# EAGLE design switch (EAGLE 5.10)
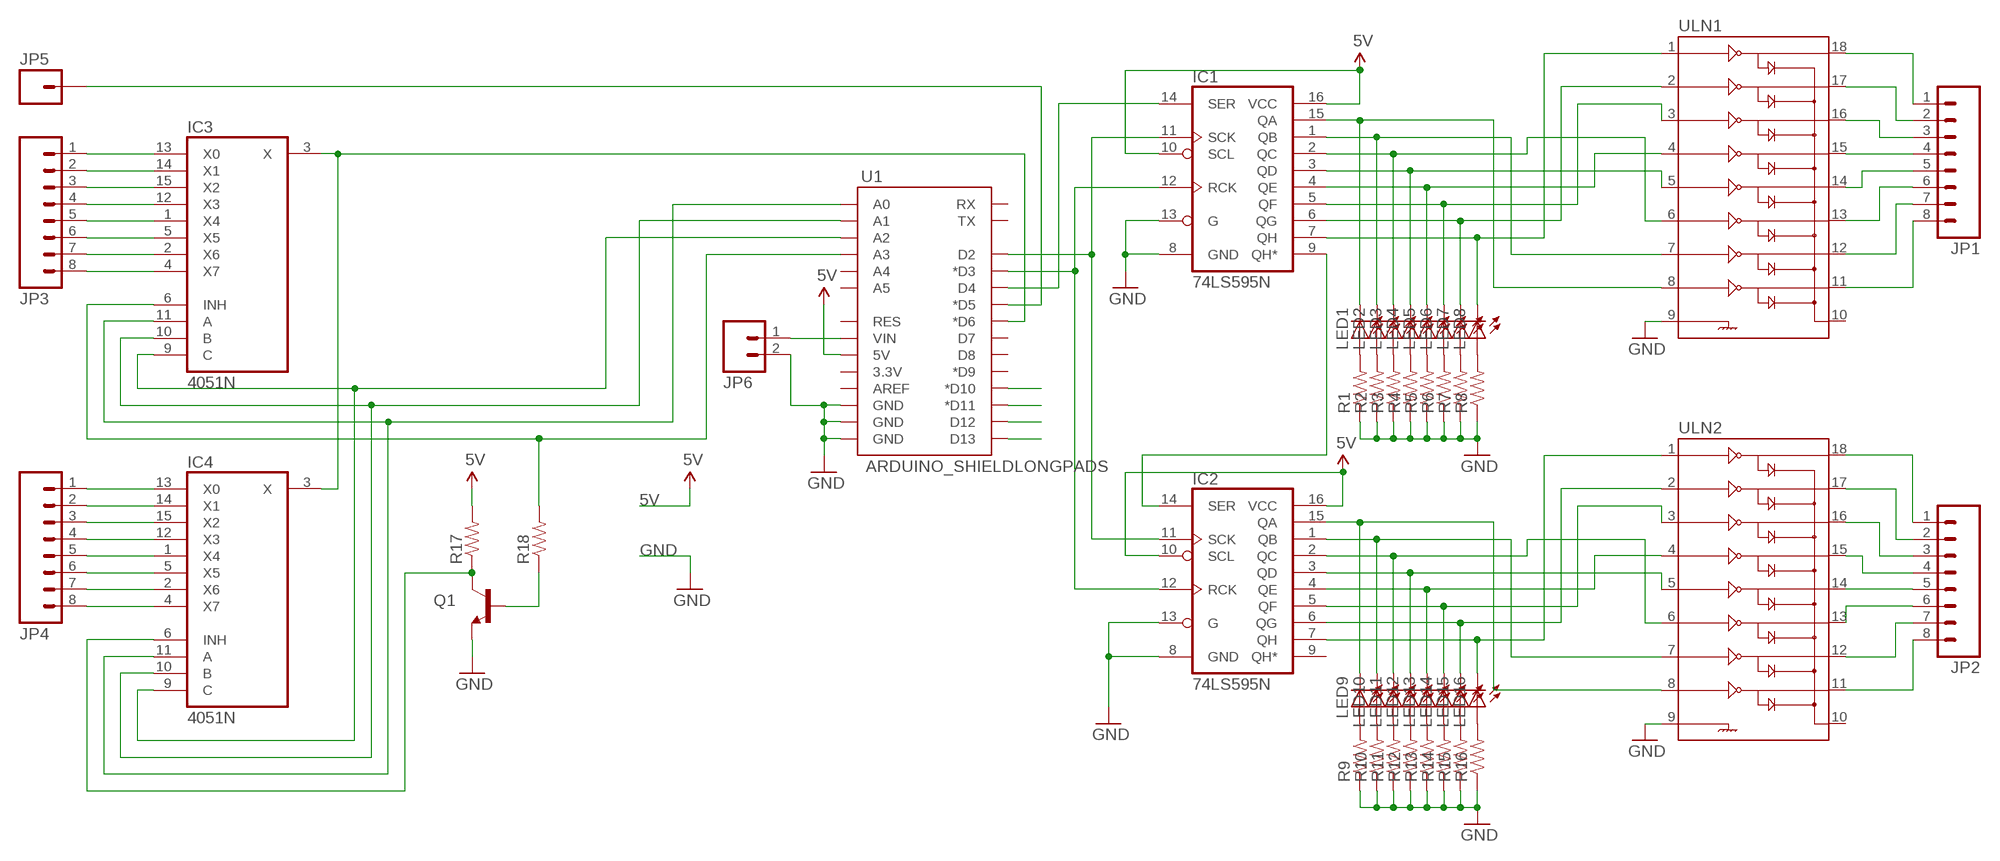
[diagram p0: schematic, sheet 1]

## Parts
IC1  74LS595N  [DIL16]
IC2  74LS595N  [DIL16]
IC3  4051N  [DIL16]
IC4  4051N  [DIL16]
JP1  M08  [1X08]
JP2  M08  [1X08]
JP3  M08  [1X08]
JP4  M08  [1X08]
JP5  M01PTH_LONGPAD  [1X01_LONGPAD]
JP6  M02PTH3  [1X02_LONGPADS]
LED1  LEDCHIPLED_0805  [CHIPLED_0805]
LED2  LEDCHIPLED_0805  [CHIPLED_0805]
LED3  LEDCHIPLED_0805  [CHIPLED_0805]
LED4  LEDCHIPLED_0805  [CHIPLED_0805]
LED5  LEDCHIPLED_0805  [CHIPLED_0805]
LED6  LEDCHIPLED_0805  [CHIPLED_0805]
LED7  LEDCHIPLED_0805  [CHIPLED_0805]
LED8  LEDCHIPLED_0805  [CHIPLED_0805]
LED9  LEDCHIPLED_0805  [CHIPLED_0805]
LED10  LEDCHIPLED_0805  [CHIPLED_0805]
LED11  LEDCHIPLED_0805  [CHIPLED_0805]
LED12  LEDCHIPLED_0805  [CHIPLED_0805]
LED13  LEDCHIPLED_0805  [CHIPLED_0805]
LED14  LEDCHIPLED_0805  [CHIPLED_0805]
LED15  LEDCHIPLED_0805  [CHIPLED_0805]
LED16  LEDCHIPLED_0805  [CHIPLED_0805]
Q1  TRANSISTOR_NPNSOT23  [SOT23]
R1  RESISTOR  [0805]
R2  RESISTOR  [0805]
R3  RESISTOR  [0805]
R4  RESISTOR  [0805]
R5  RESISTOR  [0805]
R6  RESISTOR  [0805]
R7  RESISTOR  [0805]
R8  RESISTOR  [0805]
R9  RESISTOR  [0805]
R10  RESISTOR  [0805]
R11  RESISTOR  [0805]
R12  RESISTOR  [0805]
R13  RESISTOR  [0805]
R14  RESISTOR  [0805]
R15  RESISTOR  [0805]
R16  RESISTOR  [0805]
R17  RESISTOR  [0805]
R18  RESISTOR  [0805]
U1  ARDUINO_SHIELDLONGPADS  [DUEMILANOVE_SHIELD_LONGPADS]
ULN1  ULN2803DIP  [DIL18]
ULN2  ULN2803DIP  [DIL18]

## Nets
5V: IC1.10(SCL) IC1.16(VCC) IC2.10(SCL) IC2.16(VCC) R17.2 U1.5V
GND: IC1.8(GND) IC1.13(G) IC2.8(GND) IC2.13(G) JP6.2 Q1.2(E) R1.1 R2.1 R3.1 R4.1 R5.1 R6.1 R7.1 R8.1 R9.1 R10.1 R11.1 R12.1 R13.1 R14.1 R15.1 R16.1 U1.GND@0(GND) U1.GND@1(GND) U1.GND@2(GND) ULN1.9 ULN2.9
N$1: IC1.7(QH) LED8.C ULN1.1
N$2: IC1.6(QG) LED7.C ULN1.2
N$3: IC1.5(QF) LED6.C ULN1.3
N$4: IC1.4(QE) LED5.C ULN1.4
N$5: IC1.3(QD) LED4.C ULN1.5
N$6: IC1.2(QC) LED3.C ULN1.6
N$7: IC1.1(QB) LED2.C ULN1.7
N$8: IC1.15(QA) LED1.C ULN1.8
N$9: IC1.9(QH*) IC2.14(SER)
N$10: IC3.13(X0) JP3.1
N$11: IC3.14(X1) JP3.2
N$12: IC3.15(X2) JP3.3
N$13: IC3.12(X3) JP3.4
N$14: IC1.11(SCK) IC2.11(SCK) U1.D2
N$15: IC3.1(X4) JP3.5
N$16: IC3.5(X5) JP3.6
N$17: IC3.2(X6) JP3.7
N$18: IC3.4(X7) JP3.8
N$19: JP1.1 ULN1.18
N$20: JP1.2 ULN1.17
N$21: IC1.12(RCK) IC2.12(RCK) U1.D3(*D3)
N$22: IC1.14(SER) U1.D4
N$23: JP1.3 ULN1.16
N$24: JP1.4 ULN1.15
N$25: JP1.5 ULN1.14
N$26: JP1.6 ULN1.13
N$27: JP1.7 ULN1.12
N$28: JP1.8 ULN1.11
N$29: JP2.1 ULN2.18
N$30: JP2.2 ULN2.17
N$31: JP2.3 ULN2.16
N$32: JP2.4 ULN2.15
N$33: JP2.5 ULN2.14
N$34: JP2.8 ULN2.11
N$35: JP2.7 ULN2.12
N$36: JP2.6 ULN2.13
N$37: LED1.A R1.2
N$38: LED2.A R2.2
N$39: LED3.A R3.2
N$40: LED4.A R4.2
N$41: LED5.A R5.2
N$42: LED6.A R6.2
N$43: LED7.A R7.2
N$44: LED8.A R8.2
N$45: IC2.7(QH) LED16.C ULN2.1
N$46: IC2.6(QG) LED15.C ULN2.2
N$47: IC2.5(QF) LED14.C ULN2.3
N$48: IC2.4(QE) LED13.C ULN2.4
N$49: IC2.3(QD) LED12.C ULN2.5
N$50: IC2.2(QC) LED11.C ULN2.6
N$51: IC2.1(QB) LED10.C ULN2.7
N$52: IC2.15(QA) LED9.C ULN2.8
N$53: LED9.A R9.2
N$54: LED10.A R10.2
N$55: LED11.A R11.2
N$56: LED12.A R12.2
N$57: LED13.A R13.2
N$58: LED14.A R14.2
N$59: LED15.A R15.2
N$60: LED16.A R16.2
N$61: IC4.13(X0) JP4.1
N$62: IC4.14(X1) JP4.2
N$63: IC4.15(X2) JP4.3
N$64: IC4.12(X3) JP4.4
N$65: IC4.1(X4) JP4.5
N$66: IC4.5(X5) JP4.6
N$67: IC4.2(X6) JP4.7
N$68: IC4.4(X7) JP4.8
N$69: IC3.11(A) IC4.11(A) U1.A0
N$70: IC3.10(B) IC4.10(B) U1.A1
N$71: IC3.9(C) IC4.9(C) U1.A2
N$72: IC3.6(INH) R18.2 U1.A3
N$73: JP5.1 U1.D5(*D5)
N$74: JP6.1 U1.VIN
N$75: Q1.1(B) R18.1
N$76: IC4.6(INH) Q1.3(C) R17.1
N$77: IC3.3(X) IC4.3(X) U1.D6(*D6)
N$78: U1.D13
N$79: U1.D12
N$80: U1.D11(*D11)
N$81: U1.D10(*D10)
Unconnected: IC2.9(QH*) U1.3.3V U1.A4 U1.A5 U1.AREF U1.D7 U1.D8 U1.D9(*D9) U1.RES U1.RX U1.TX ULN1.10 ULN2.10

## Power pins joined to a net without a drawn wire
5V: IC3.16(VCC) IC4.16(VCC)
GND: IC3.7(VEE) IC3.8(GND) IC4.7(VEE) IC4.8(GND)

## Library data of the parts
IC1 IC2 = SparkFun:74*595: 8-bit SHIFT REGISTER, output latch
IC3 IC4 = 40xx:4051: 8-channel ANALOG MULTIPLEXER
JP1-JP4 = SparkFun:M08: Header 8 Standard 8-pin 0.1" header. Use with straight break away headers (SKU : PRT-00116), right angle break away headers (PRT-00553), swiss pins (PRT-00743), machine pins (PRT-00117), and female headers (PRT-00115).
JP5 = SparkFunJan12:M01: Header 1 Standard 1-pin 0.1" header. Use with straight break away headers (SKU : PRT-00116), right angle break away headers (PRT-00553), swiss pins (PRT-00743), machine pins (PRT-00117), and female headers (PRT-00115).
JP6 = SparkFunJan12:M02: Header 2 Standard 2-pin 0.1" header. Use with straight break away headers (SKU : PRT-00116), right angle break away headers (PRT-00553), swiss pins (PRT-00743), machine pins (PRT-00117), and female headers (PRT-00115). Molex polarized connector foot print use with SKU : PRT-08233 with associated crimp pins and housings.
LED1-LED16 = led:LED: LED OSRAM: - CHIPLED LG R971, LG N971, LY N971, LG Q971, LY Q971, LO R971, LY R971 LH N974, LH R974 LS Q976, LO Q976, LY Q976 LO Q996 - Hyper CHIPLED LW Q18S LB Q993, LB Q99A, LB R99A - SideLED LS A670, LO A670, LY A670, LG A670, LP A670 LB A673, LV A673, LT A673, LW A673 LH A674 LY A675 LS A676, LA A676, LO A676, LY A676, LW A676 LS A679, LY A679, LG A679 - Hyper Micro SIDELED® LS Y876, LA Y876, LO Y876, LY Y876 LT Y87S - SmartLED LW L88C, LW L88S LB L89C, LB L89S, LG L890 LS L89K, LO L89K, LY L89K LS L896, LA L896, LO L896, LY L896 - TOPLED LS T670, LO T670, LY T670, LG T670, LP T670 LSG T670, LSP T670, LSY T670, LOP T670, LYG T670 LG T671, LOG T671, LSG T671 LB T673, LV T673, LT T673, LW T673 LH T674 LS T676, LA T676, LO T676, LY T676, LB T676, LH T676, LSB T676, LW T676 LB T67C, LV T67C, LT T67C, LS T67K, LO T67K, LY T67K, LW E67C LS E67B, LA E67B, LO E67B, LY E67B, LB E67C, LV E67C, LT E67C LW T67C LS T679, LY T679, LG T679 LS T770, LO T770, LY T770, LG T770, LP T770 LB T773, LV T773, LT T773, LW T773 LH T774 LS E675, LA E675, LY E675, LS T675 LS T776, LA T776, LO T776, LY T776, LB T776 LHGB T686 LT T68C, LB T68C - Hyper Mini TOPLED® LB M676 - Mini TOPLED Santana® LG M470 LS M47K, LO M47K, LY M47K Source: http://www.osram.convergy.de LUXEON: - LUMILED® LXK2-PW12-R00, LXK2-PW12-S00, LXK2-PW14-U00, LXK2-PW14-V00 LXK2-PM12-R00, LXK2-PM12-S00, LXK2-PM14-U00 LXK2-PE12-Q00, LXK2-PE12-R00, LXK2-PE12-S00, LXK2-PE14-T00, LXK2-PE14-U00 LXK2-PB12-K00, LXK2-PB12-L00, LXK2-PB12-M00, LXK2-PB14-N00, LXK2-PB14-P00, LXK2-PB14-Q00 LXK2-PR12-L00, LXK2-PR12-M00, LXK2-PR14-Q00, LXK2-PR14-R00 LXK2-PD12-Q00, LXK2-PD12-R00, LXK2-PD12-S00 LXK2-PH12-R00, LXK2-PH12-S00 LXK2-PL12-P00, LXK2-PL12-Q00, LXK2-PL12-R00 Source: www.luxeon.com KINGBRIGHT: KA-3528ASYC Source: www.kingbright.com
Q1 = SparkFunJan12:TRANSISTOR_NPN: Transistor NPN BJT configuration in SOT23 package. MMBT2222 is the common NPN we use. Double check BCE configuration again layout.
R1-R18 = SparkFun:RESISTOR: Resistor Basic schematic elements and footprints for 0603, 1206, and PTH 1/10th watt (small) resistors.
U1 = SparkFun:ARDUINO_SHIELD
ULN1 ULN2 = SparkFun:ULN2803: Darlington Driver ULN2803 Darlington array. 500mA max per channel, 8-channel package. Spark Fun Electronics SKU : COM-00312

## Board
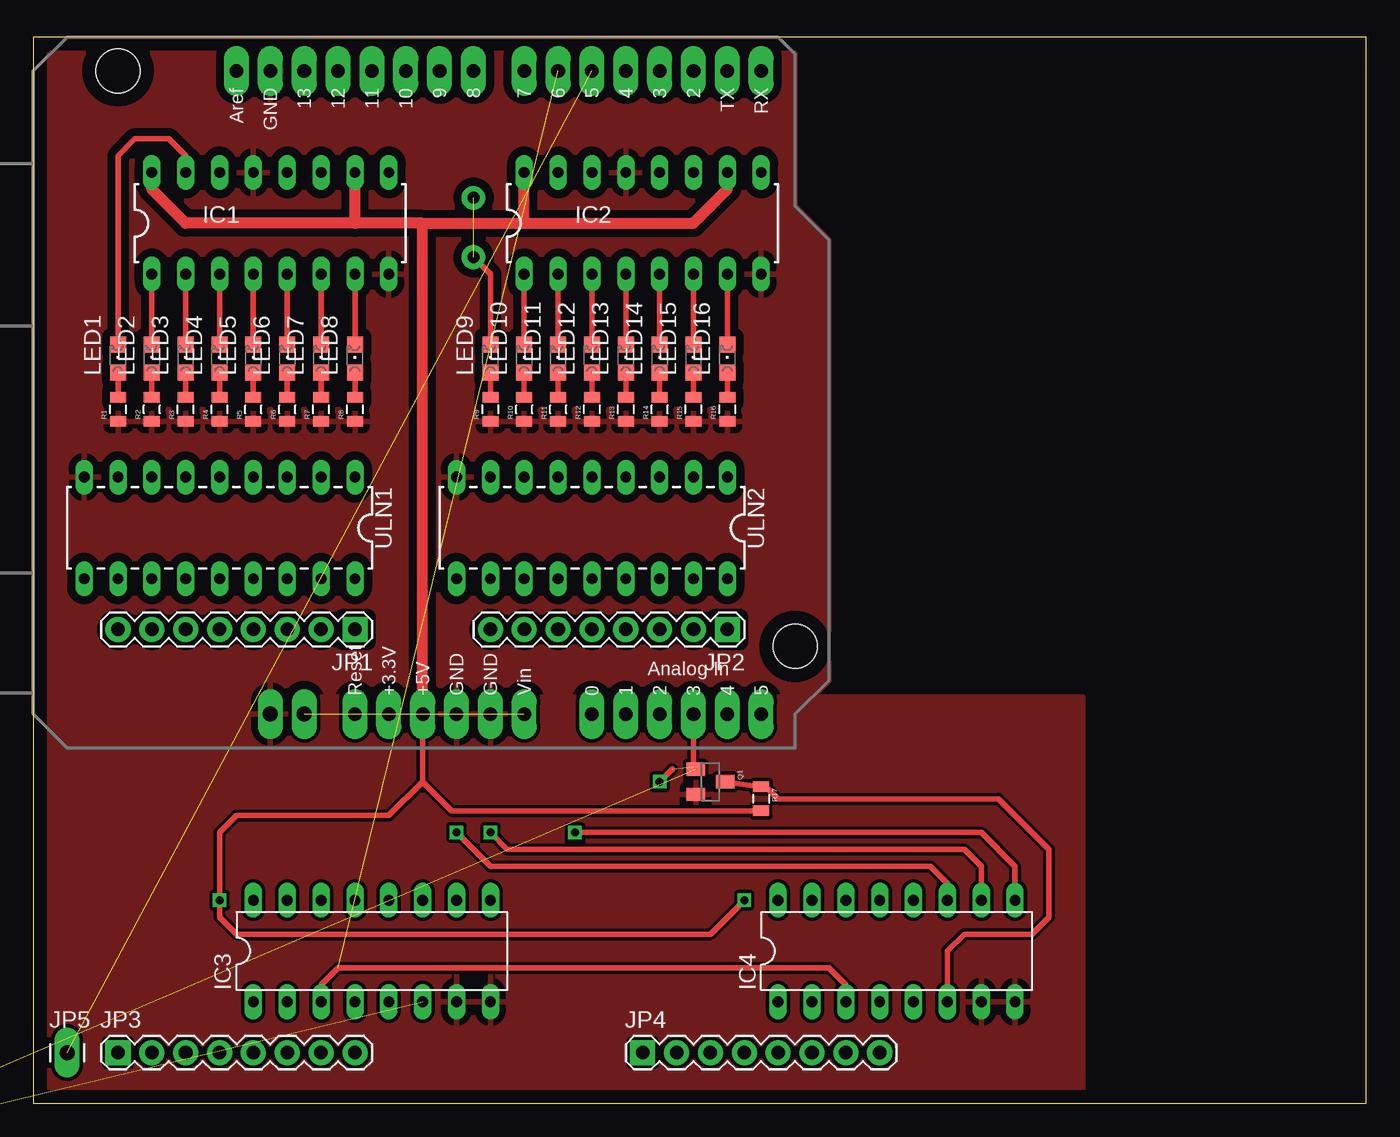
[diagram p1: board, top side]
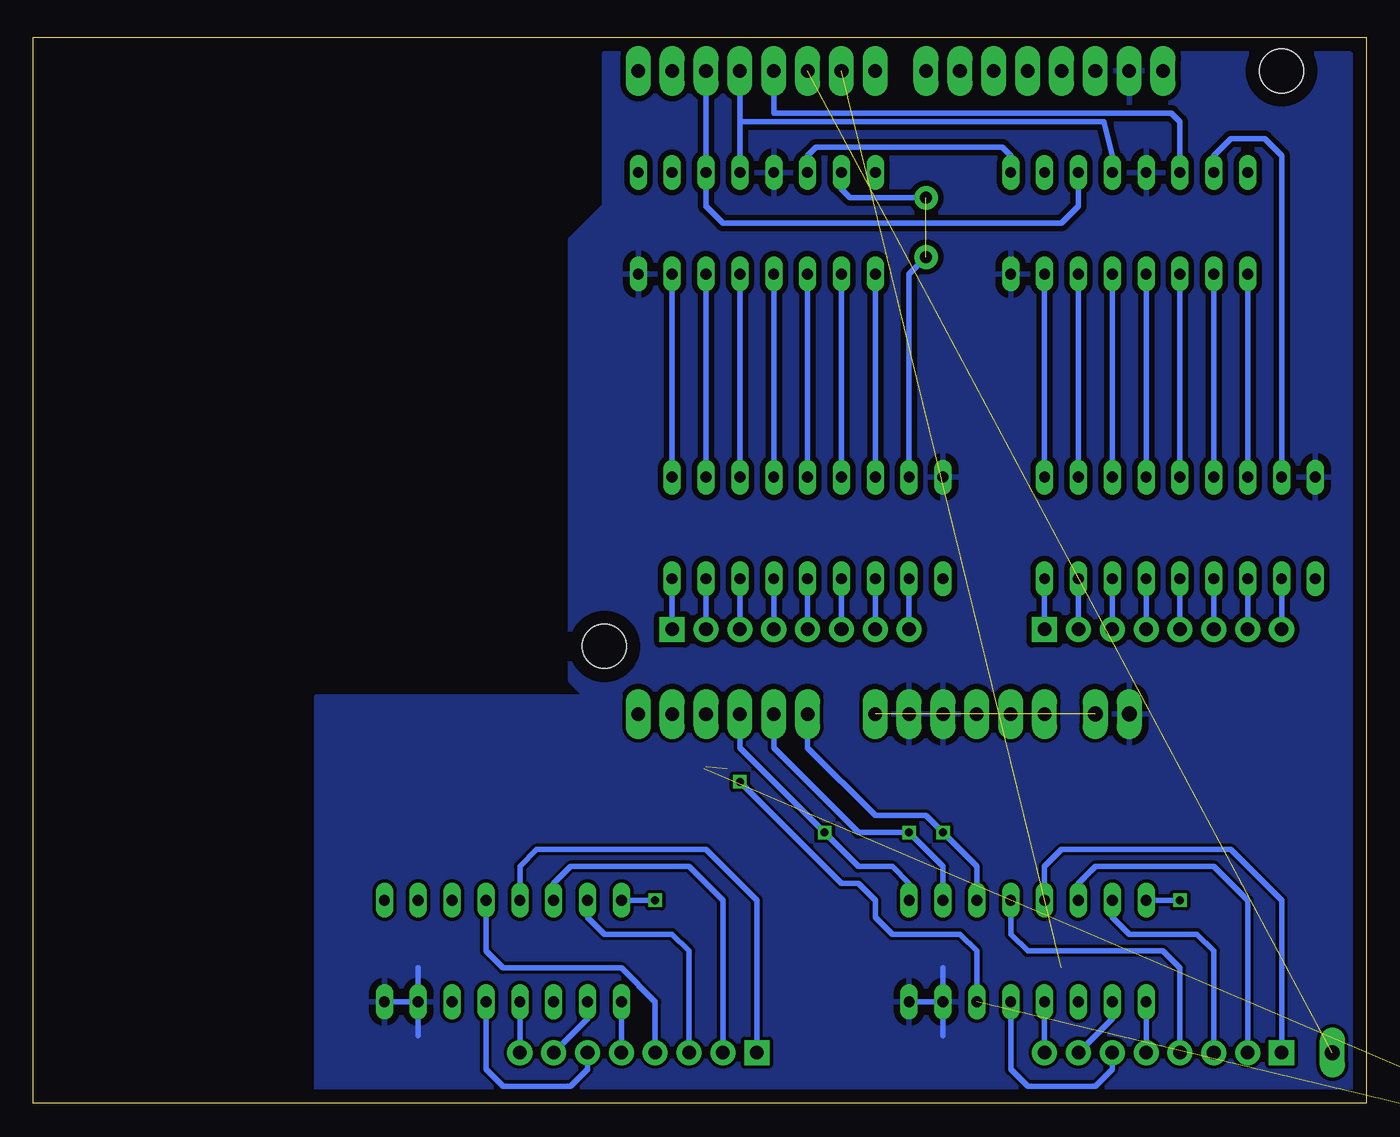
[diagram p2: board, bottom side, seen from below]

Size 100 x 80 mm. Coordinates in mm from the lower left corner, seen from the top.
Outline: 0,0 100,0 100,80 0,80 0,0
Copper layers (1*16): Top 0.035mm / dielectric 1.5mm / Bottom 0.035mm
Design rules "LWK PCB Home *": minimum track width 10mil, minimum drill 24mil, track to track 10mil, track to pad 10mil, pad to pad 10mil, via to via 8mil, smd to smd 10mil, copper to edge 40mil, drill to drill 8mil, minimum pad ring 10mil, minimum via ring 8mil, stop-mask expansion 4mil, vias tented up to drill 0mil, thermal gap 20mil

### Footprints (pad centres in the part's own frame; a part is rotated, then mirrored left to right if it is on the bottom)
DIL16 = drill 0.813 long: 1 -8.89,-3.81; 2 -6.35,-3.81; 3 -3.81,-3.81; 4 -1.27,-3.81; 5 1.27,-3.81; 6 3.81,-3.81; 7 6.35,-3.81; 8 8.89,-3.81; 9 8.89,3.81; 10 6.35,3.81; 11 3.81,3.81; 12 1.27,3.81; 13 -1.27,3.81; 14 -3.81,3.81; 15 -6.35,3.81; 16 -8.89,3.81
1X08 = drill 1.016 pad 1.88 square: 1 0,0 | drill 1.016 pad 1.88 round: 2 2.54,0; 3 5.08,0; 4 7.62,0; 5 10.16,0; 6 12.7,0; 7 15.24,0; 8 17.78,0
1X01_LONGPAD = drill 1.118 pad 1.88 long: 1 0,0
1X02_LONGPADS = drill 1.118 pad 1.88 long: 1 0,0; 2 2.54,0
CHIPLED_0805 = smd 1.2 x 1.2: A 0,-1.05; C 0,1.05
SOT23 = smd 1 x 1.4: 1 -0.95,-1.1; 2 0.95,-1.1; 3 0,1.1
0805 = smd 0.8 x 1.2: 1 -0.9,0; 2 0.9,0
DUEMILANOVE_SHIELD_LONGPADS = drill 1.016 pad 1.88 long: 3.3V 50.8,26.67; 5V 50.8,29.21; A0 50.8,41.91; A1 50.8,44.45; A2 50.8,46.99; A3 50.8,49.53; A4 50.8,52.07; A5 50.8,54.61; AREF 2.54,15.24; D2 2.54,49.53; D3 2.54,46.99; D4 2.54,44.45; D5 2.54,41.91; D6 2.54,39.37; D7 2.54,36.83; D8 2.54,33.02; D9 2.54,30.48; D10 2.54,27.94; D11 2.54,25.4; D12 2.54,22.86; D13 2.54,20.32; GND@0 50.8,31.75; GND@1 50.8,34.29; GND@2 2.54,17.78; RES 50.8,24.13; RX 2.54,54.61; TX 2.54,52.07; VIN 50.8,36.83 | hole 3.302: 45.72,57.15; 2.54,6.35
DIL18 = drill 0.813 long: 1 -10.16,-3.81; 2 -7.62,-3.81; 3 -5.08,-3.81; 4 -2.54,-3.81; 5 0,-3.81; 6 2.54,-3.81; 7 5.08,-3.81; 8 7.62,-3.81; 9 10.16,-3.81; 10 10.16,3.81; 11 7.62,3.81; 12 5.08,3.81; 13 2.54,3.81; 14 0,3.81; 15 -2.54,3.81; 16 -5.08,3.81; 17 -7.62,3.81; 18 -10.16,3.81

### Placement (x,y rotation side)
IC1  17.78,66.04 0 top
IC2  45.72,66.04 0 top
IC3  25.4,11.43 0 top
IC4  64.77,11.43 0 top
JP1  24.13,35.56 180 top
JP2  52.07,35.56 180 top
JP3  6.35,3.81 0 top
JP4  45.72,3.81 0 top
JP5  2.54,3.81 0 top
JP6  20.32,29.21 180 top
LED1  6.35,55.88 0 top
LED2  8.89,55.88 0 top
LED3  11.43,55.88 0 top
LED4  13.97,55.88 0 top
LED5  16.51,55.88 0 top
LED6  19.05,55.88 0 top
LED7  21.59,55.88 0 top
LED8  24.13,55.88 0 top
LED9  34.29,55.88 0 top
LED10  36.83,55.88 0 top
LED11  39.37,55.88 0 top
LED12  41.91,55.88 0 top
LED13  44.45,55.88 0 top
LED14  46.99,55.88 0 top
LED15  49.53,55.88 0 top
LED16  52.07,55.88 0 top
Q1  50.8,24.13 270 top
R1  6.35,52.07 90 top
R2  8.89,52.07 90 top
R3  11.43,52.07 90 top
R4  13.97,52.07 90 top
R5  16.51,52.07 90 top
R6  19.05,52.07 90 top
R7  21.59,52.07 90 top
R8  24.13,52.07 90 top
R9  34.29,52.07 90 top
R10  36.83,52.07 90 top
R11  39.37,52.07 90 top
R12  41.91,52.07 90 top
R13  44.45,52.07 90 top
R14  46.99,52.07 90 top
R15  49.53,52.07 90 top
R16  52.07,52.07 90 top
R17  54.61,22.86 270 top
R18  -13.97,-2.54 0 top  (outside the outline)
U1  0,80.01 270 top
ULN1  13.97,43.18 180 top
ULN2  41.91,43.18 180 top

### Tracks (layer width: path | path; a pad name or v marks a point on that pad's centre or on a via)
5V  (via drill 0.6)
  Top 0.406: v53.34,15.24 50.8,12.7 15.24,12.7 13.97,13.97 v13.97,15.24 13.97,20.32 15.24,21.59 26.67,21.59 29.21,24.13 | 29.21,24.13 U1.5V | R17.2 31.38,21.96 29.21,24.13
  Top 0.813: U1.5V 29.21,66.04 | 29.21,66.04 24.13,66.04 | 24.13,66.04 11.43,66.04 8.89,68.58 IC1.16 | 24.13,66.04 IC1.10 | 29.21,66.04 36.83,66.04 | 36.83,66.04 49.53,66.04 52.07,68.58 IC2.10 | 36.83,66.04 IC2.16
  Bottom 0.406: v53.34,15.24 IC4.16 | v13.97,15.24 IC3.16
GND
  Bottom 0.406: IC3.7 IC3.8 | IC3.7 31.75,10.16 | 31.75,5.08 IC3.7 | IC4.7 IC4.8 | IC4.7 71.12,10.16 | 71.12,5.08 IC4.7
  pour Bottom (isolate 0.406): 2.54,80.01 0,77.47 0,29.21 2.54,26.67 57.15,26.67 57.15,29.21 59.69,31.75 59.69,64.77 57.15,67.31 57.15,78.74 55.88,80.01
  pour Top (isolate 0.61): 2.54,80.01 0,77.47 0,29.21 2.54,26.67 57.15,26.67 57.15,29.21 59.69,31.75 59.69,64.77 57.15,67.31 57.15,78.74 55.88,80.01
  pour Top: 0,27.94 0,0 78.74,0 78.74,30.48 0,30.48
  pour Bottom: 0,27.94 0,0 78.74,0 78.74,30.48 0,30.48
N$1
  Top 0.406: IC1.7 LED8.C
  Bottom 0.406: ULN1.1 IC1.7
N$2
  Top 0.406: IC1.6 LED7.C
  Bottom 0.406: ULN1.2 IC1.6
N$3
  Top 0.406: IC1.5 LED6.C
  Bottom 0.406: ULN1.3 IC1.5
N$4
  Top 0.406: IC1.4 LED5.C
  Bottom 0.406: ULN1.4 IC1.4
N$5
  Top 0.406: IC1.3 LED4.C
  Bottom 0.406: ULN1.5 IC1.3
N$6
  Top 0.406: IC1.2 LED3.C
  Bottom 0.406: ULN1.6 IC1.2
N$7
  Top 0.406: IC1.1 LED2.C
  Bottom 0.406: ULN1.7 IC1.1
N$8
  Top 0.406: LED1.C 6.35,71.12 7.62,72.39 10.16,72.39 11.43,71.12 IC1.15
  Bottom 0.406: ULN1.8 6.35,71.12 7.62,72.39 10.16,72.39 11.43,71.12 IC1.15
N$9
  Bottom 0.406: IC1.9 26.67,71.12 27.3,71.75 41.27,71.75 41.91,71.12 IC2.14
N$10
  Bottom 0.406: JP3.1 6.35,15.24 10.16,19.05 22.86,19.05 24.13,17.78 IC3.13
N$11
  Bottom 0.406: JP3.2 8.89,15.24 11.43,17.78 20.32,17.78 21.59,16.51 IC3.14
N$12
  Bottom 0.406: IC3.15 19.05,13.97 17.78,12.7 12.7,12.7 11.43,11.43 JP3.3
N$13
  Bottom 0.406: JP3.4 13.97,10.16 15.24,11.43 25.4,11.43 26.67,12.7 IC3.12
N$14
  Bottom 0.406: U1.D2 IC2.11 49.53,67.31 48.26,66.04 22.86,66.04 21.59,67.31 IC1.11
N$15
  Bottom 0.406: JP3.5 IC3.1
N$16
  Bottom 0.406: IC3.5 26.67,2.54 25.4,1.27 20.32,1.27 19.05,2.54 JP3.6
N$17
  Bottom 0.406: JP3.7 19.05,6.35 IC3.2
N$18
  Bottom 0.406: JP3.8 IC3.4
N$19
  Bottom 0.406: JP1.1 ULN1.18
N$20
  Bottom 0.406: JP1.2 ULN1.17
N$21
  Bottom 0.406: IC1.12 19.05,71.12 19.68,73.66 46.99,73.66 | 46.99,73.66 IC2.12 | 46.99,73.66 U1.D3
N$22
  Bottom 0.406: U1.D4 44.45,74.3 14.61,74.3 13.97,73.66 IC1.14
N$23
  Bottom 0.406: JP1.3 ULN1.16
N$24
  Bottom 0.406: JP1.4 ULN1.15
N$25
  Bottom 0.406: JP1.5 ULN1.14
N$26
  Bottom 0.406: JP1.6 ULN1.13
N$27
  Bottom 0.406: JP1.7 ULN1.12
N$28
  Bottom 0.406: JP1.8 ULN1.11
N$29
  Bottom 0.406: JP2.1 ULN2.18
N$30
  Bottom 0.406: JP2.2 ULN2.17
N$31
  Bottom 0.406: JP2.3 ULN2.16
N$32
  Bottom 0.406: JP2.4 ULN2.15
N$33
  Bottom 0.406: JP2.5 ULN2.14
N$34
  Bottom 0.406: JP2.8 ULN2.11
N$35
  Bottom 0.406: JP2.7 ULN2.12
N$36
  Bottom 0.406: JP2.6 ULN2.13
N$37
  Top 0.406: R1.2 LED1.A
N$38
  Top 0.406: R2.2 LED2.A
N$39
  Top 0.406: R3.2 LED3.A
N$40
  Top 0.406: R4.2 LED4.A
N$41
  Top 0.406: R5.2 LED5.A
N$42
  Top 0.406: R6.2 LED6.A
N$43
  Top 0.406: R7.2 LED7.A
N$44
  Top 0.406: R8.2 LED8.A
N$45
  Top 0.406: IC2.7 LED16.C
  Bottom 0.406: ULN2.1 IC2.7
N$46
  Top 0.406: IC2.6 LED15.C
  Bottom 0.406: 49.53,48.26 ULN2.2 IC2.6
N$47
  Top 0.406: IC2.5 LED14.C
  Bottom 0.406: ULN2.3 IC2.5
N$48
  Top 0.406: IC2.4 LED13.C
  Bottom 0.406: ULN2.4 IC2.4
N$49
  Top 0.406: IC2.3 LED12.C
  Bottom 0.406: ULN2.5 IC2.3
N$50
  Top 0.406: IC2.2 LED11.C
  Bottom 0.406: 39.37,48.26 ULN2.6 IC2.2
N$51
  Top 0.406: IC2.1 LED10.C
  Bottom 0.406: ULN2.7 IC2.1
N$52  (via drill 0.9 pad 1.78)  (1 unrouted)
  Top 0.406: v33.02,63.5 34.29,62.23 LED9.C
  Bottom 0.406: IC2.15 39.37,68.58 38.73,67.94 v33.02,67.94 | ULN2.8 34.29,62.23 v33.02,63.5
N$53
  Top 0.406: R9.2 LED9.A
N$54
  Top 0.406: R10.2 LED10.A
N$55
  Top 0.406: R11.2 LED11.A
N$56
  Top 0.406: R12.2 LED12.A
N$57
  Top 0.406: R13.2 LED13.A
N$58
  Top 0.406: R14.2 LED14.A
N$59
  Top 0.406: R15.2 LED15.A
N$60
  Top 0.406: R16.2 LED16.A
N$61
  Bottom 0.406: JP4.1 45.72,15.24 49.53,19.05 62.23,19.05 63.5,17.78 IC4.13
N$62
  Bottom 0.406: JP4.2 48.26,15.24 50.8,17.78 59.69,17.78 60.96,16.51 IC4.14
N$63
  Bottom 0.406: IC4.15 58.42,13.97 57.15,12.7 52.07,12.7 50.8,11.43 JP4.3
N$64
  Bottom 0.406: IC4.12 66.04,11.43 64.77,10.16 55.88,10.16 53.34,7.62 JP4.4
N$65
  Bottom 0.406: JP4.5 IC4.1
N$66
  Bottom 0.406: JP4.6 58.42,2.54 59.69,1.27 64.77,1.27 66.04,2.54 IC4.5
N$67
  Bottom 0.406: JP4.7 58.42,6.35 IC4.2
N$68
  Bottom 0.406: JP4.8 IC4.4
N$69  (via drill 0.6)
  Top 0.406: IC4.11 68.58,16.51 67.31,17.78 34.29,17.78 v31.75,20.32
  Bottom 0.406: IC3.11 29.21,17.78 v31.75,20.32 33.02,21.59 36.83,21.59 41.91,26.67 U1.A0
N$70  (via drill 0.6)
  Top 0.406: v34.29,20.32 35.56,19.05 69.85,19.05 71.12,17.78 IC4.10
  Bottom 0.406: IC3.10 31.75,17.78 v34.29,20.32 38.1,20.32 44.45,26.67 U1.A1
N$71  (via drill 0.6)
  Top 0.406: IC4.9 73.66,17.78 71.12,20.32 v40.64,20.32
  Bottom 0.406: IC3.9 34.29,16.51 35.56,17.78 38.1,17.78 v40.64,20.32 46.99,26.67 U1.A2
N$72  (via drill 0.6)  (2 unrouted)
  Top 0.406: 49.53,25.25 U1.A3 | v46.99,24.13 47.94,25.08
  Bottom 0.406: v46.99,24.13 39.37,16.51 38.1,16.51 36.83,15.24 36.83,13.97 35.56,12.7 30.48,12.7 29.21,11.43 IC3.6
N$73  (1 unrouted)
N$74  (1 unrouted)
N$75  (1 unrouted)
N$76
  Top 0.406: Q1.3 R17.1 54.98,23.76 55.88,22.86 72.39,22.86 76.2,19.05 76.2,13.97 74.93,12.7 69.85,12.7 68.58,11.43 IC4.6
N$77  (1 unrouted)
  Top 0.406: IC3.3 21.59,8.89 22.86,10.16 59.69,10.16 60.96,8.89 IC4.3